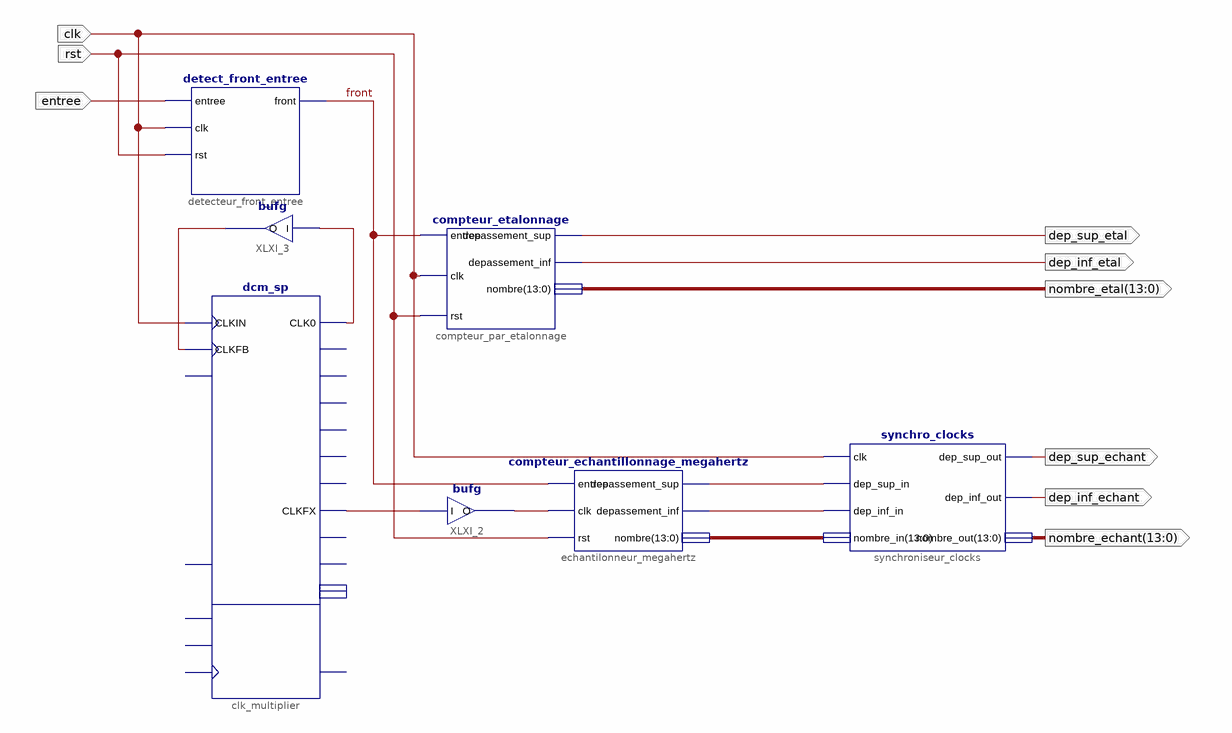
[diagram p0: schematic sheet 1]
// Xilinx ISE schematic compteurs.sch (spartan3e) as structural Verilog: 7 symbols, 9 ports
module compteurs (
  input  rst,
  input  clk,
  input  entree,
  output dep_inf_etal,
  output dep_sup_etal,
  output [13:0] nombre_etal,
  output [13:0] nombre_echant,
  output dep_inf_echant,
  output dep_sup_echant
);

  wire front, XLXN_4, XLXN_5, XLXN_6, XLXN_25, XLXN_26, XLXN_39;
  wire [13:0] XLXN_24;

  detect_front_entree detecteur_front_entree (.entree(entree), .clk(clk), .front(front), .rst(rst));
  compteur_etalonnage compteur_par_etalonnage (
    .entree(front), .clk(clk), .rst(rst), .depassement_sup(dep_sup_etal), .depassement_inf(dep_inf_etal),
    .nombre(nombre_etal));
  dcm_sp #(.CLKFX_MULTIPLY(2)) clk_multiplier (
    .CLKFB(XLXN_6), .CLKIN(clk), .CLK0(XLXN_5), .CLKFX(XLXN_39));  // open: DSSEN, PSCLK, PSEN, PSINCDEC, RST, CLK180, CLK270, CLK2X, CLK2X180, CLK90, CLKDV, CLKFX180, LOCKED, PSDONE, STATUS
  bufg XLXI_3 (.I(XLXN_5), .O(XLXN_6));
  compteur_echantillonnage_megahertz echantilonneur_megahertz (
    .entree(front), .clk(XLXN_4), .rst(rst), .depassement_sup(XLXN_25), .depassement_inf(XLXN_26),
    .nombre(XLXN_24));
  synchro_clocks synchroniseur_clocks (
    .nombre_in(XLXN_24), .dep_sup_out(dep_sup_echant), .dep_inf_out(dep_inf_echant),
    .nombre_out(nombre_echant), .dep_sup_in(XLXN_25), .dep_inf_in(XLXN_26), .clk(clk));
  bufg XLXI_2 (.I(XLXN_39), .O(XLXN_4));
endmodule
